# EAGLE design ESP8266Controller (EAGLE 7.6.0)
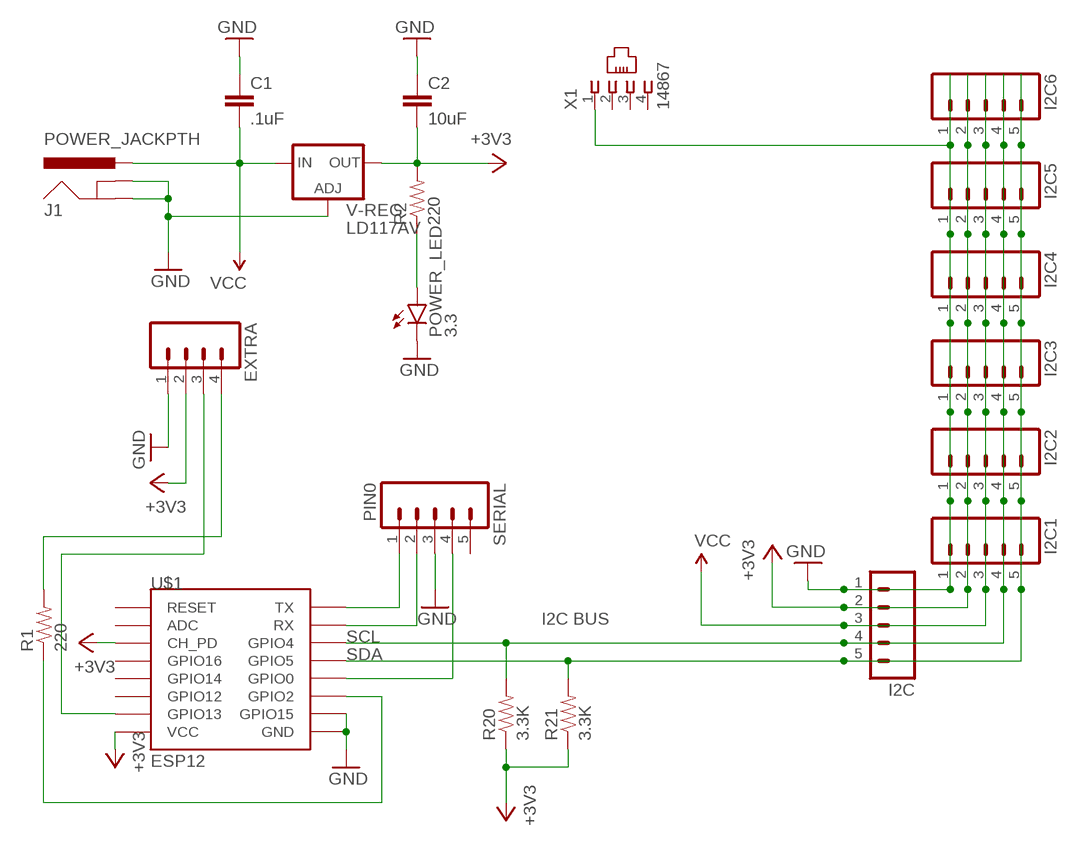
[diagram p0: schematic, sheet 1]

## Parts
C1  .1uF  CAPPTH  [CAP-PTH-SMALL]
C2  10uF  CAPPTH  [CAP-PTH-SMALL]
EXTRA  M04  [04P]
I2C  M05  [05P]
I2C1  M05  [05P]
I2C2  M05  [05P]
I2C3  M05  [05P]
I2C4  M05  [05P]
I2C5  M05  [05P]
I2C6  M05  [05P]
J1  POWER_JACKPTH  [POWER_JACK_PTH]
POWER_LED  3.3  LED5MM  [LED5MM]
R1  220  RESISTORPTH-1/4W  [AXIAL-0.4]
R2  220  RESISTORPTH-1/4W  [AXIAL-0.4]
R20  3.3K  RESISTORPTH-1/4W  [AXIAL-0.4]
R21  3.3K  RESISTORPTH-1/4W  [AXIAL-0.4]
SERIAL  PIN0  M05  [05P]
U$1  ESP12  [ESP12]
V-REG  LD117AV  [TO220L1]
X1  14867  [14867]

## Nets
+3V3: C2.2 EXTRA.2 I2C1.2 I2C2.2 I2C3.2 I2C4.2 I2C5.2 I2C6.2 I2C.2 R2.P$2 R20.P$1 R21.P$1 U$1.CH_PD U$1.VCC V-REG.2(OUT)
GND: C1.1 C2.1 EXTRA.1 I2C1.1 I2C2.1 I2C3.1 I2C4.1 I2C5.1 I2C6.1 I2C.1 J1.GND J1.GNDBREAK POWER_LED.K(C) SERIAL.3 U$1.GND U$1.GPIO15 V-REG.1(ADJ) X1.1
N$1: EXTRA.4 R1.P$2
N$2: R1.P$1 U$1.GPIO2
N$3: EXTRA.3 U$1.GPIO13
N$4: SERIAL.1 U$1.TX
N$7: POWER_LED.A R2.P$1
N$11: SERIAL.2 U$1.RX
N$19: SERIAL.4 U$1.GPIO0
SCL: I2C1.4 I2C2.4 I2C3.4 I2C4.4 I2C5.4 I2C6.4 I2C.4 R20.P$2 U$1.GPIO4
SDA: I2C1.5 I2C2.5 I2C3.5 I2C4.5 I2C5.5 I2C6.5 I2C.5 R21.P$2 U$1.GPIO5
VCC: C1.2 I2C1.3 I2C2.3 I2C3.3 I2C4.3 I2C5.3 I2C6.3 I2C.3 J1.PWR V-REG.3(IN)
Unconnected: SERIAL.5 U$1.ADC U$1.GPIO12 U$1.GPIO14 U$1.GPIO16 U$1.RESET X1.2 X1.3 X1.4

## Notes on the sheet
- I2C BUS

## Library data of the parts
C1 C2 = SparkFun-Capacitors:CAP: Capacitor Standard 0603 ceramic capacitor, and 0.1" leaded capacitor.
EXTRA = con-amp-quick:M04: AMP QUICK CONNECTOR; OC_FARNELL: unknown; OC_NEWARK: unknown
I2C I2C1-I2C6 SERIAL = con-amp-quick:M05: AMP QUICK CONNECTOR; OC_FARNELL: unknown; OC_NEWARK: unknown
J1 = SparkFun-Connectors:POWER_JACK: Power Jack This is the standard 5.5mm barrel jack for power. The PTH is the most common, proven, reliable, footprint. The Slot footprint only works if the mill layer is transmitted to the PCB fab house so be warned. Mating wall wart : TOL-00298 (and others); PROD_ID: CONN-08197
POWER_LED = SparkFun-LED:LED: LEDs Standard schematic elements and footprints for 5mm, 3mm, 1206, and 0603 sized LEDs. 5mm - Spark Fun Electronics SKU : COM-00529 (and others)
R1 R2 R20 R21 = SparkFun-Resistors:RESISTOR: Resistor Basic schematic elements and footprints for 0603, 1206, and PTH resistors.
U$1 = esp8266modules:ESP12: ESP8266 Wifi module 12
V-REG = v-reg:LD117A?*: Low drop fixed and adjustable positive voltage regulators 1 A Source: http://www.st.com/stonline/products/literature/ds/7194/ld1117axx.pdf
X1 = con-4ucon:14867: RJ11 Connector Source: 4UCON TECHNOLOGY INC. 14867.pdf; OC_FARNELL: unknown; OC_NEWARK: unknown

## Board
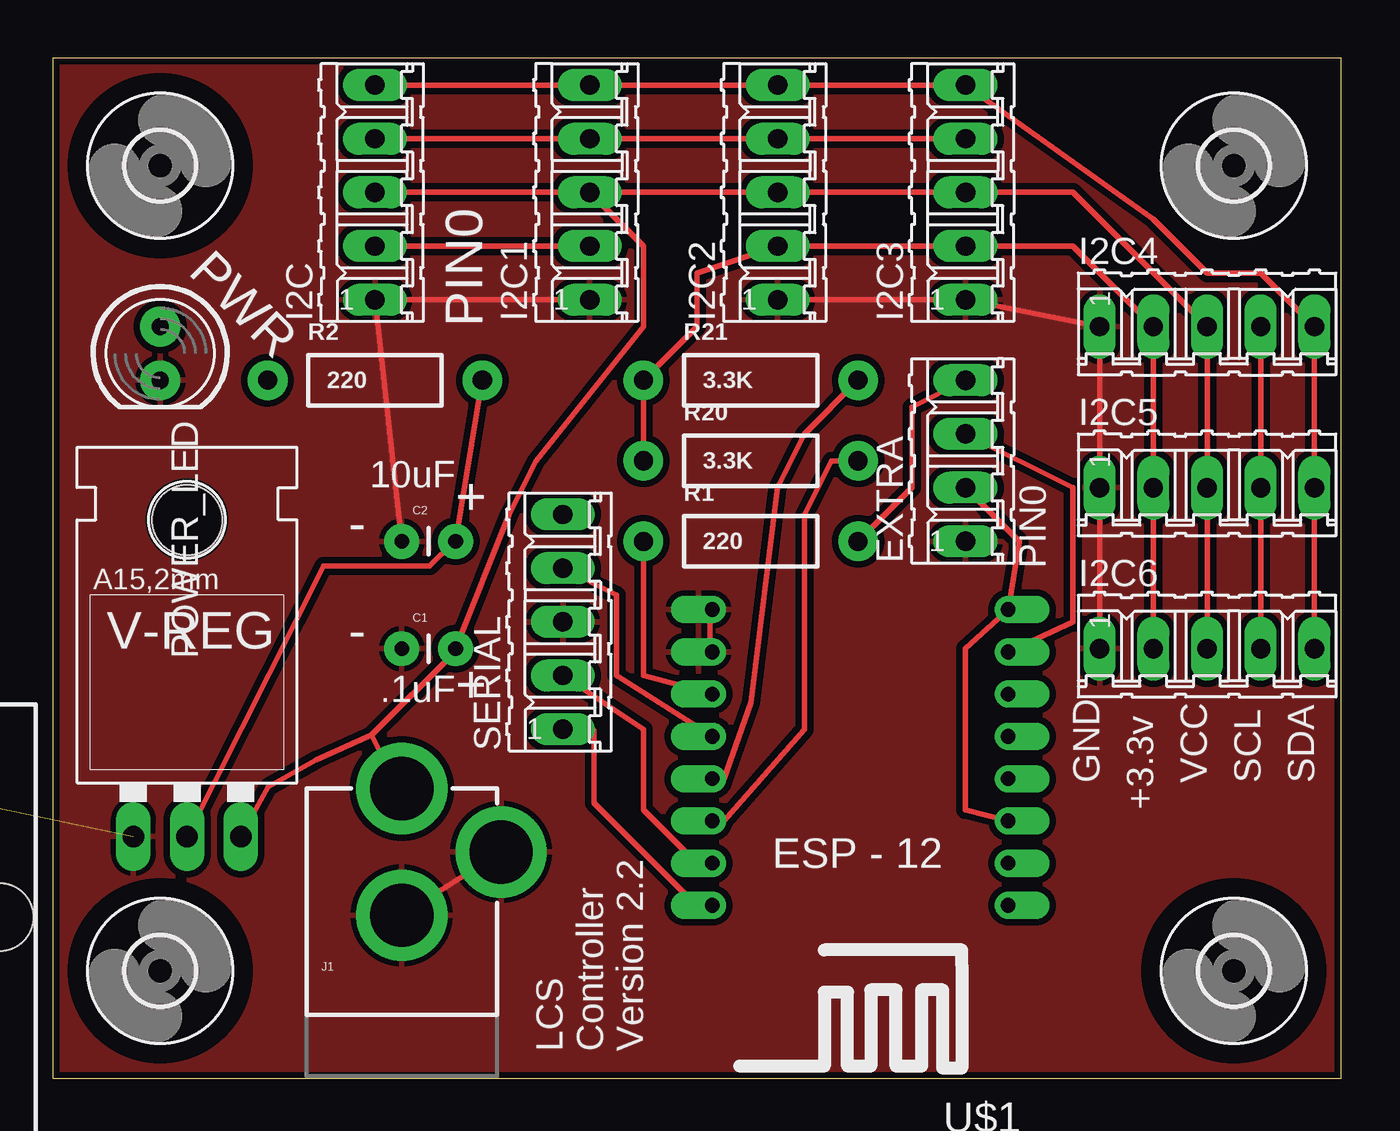
[diagram p1: board, top side]
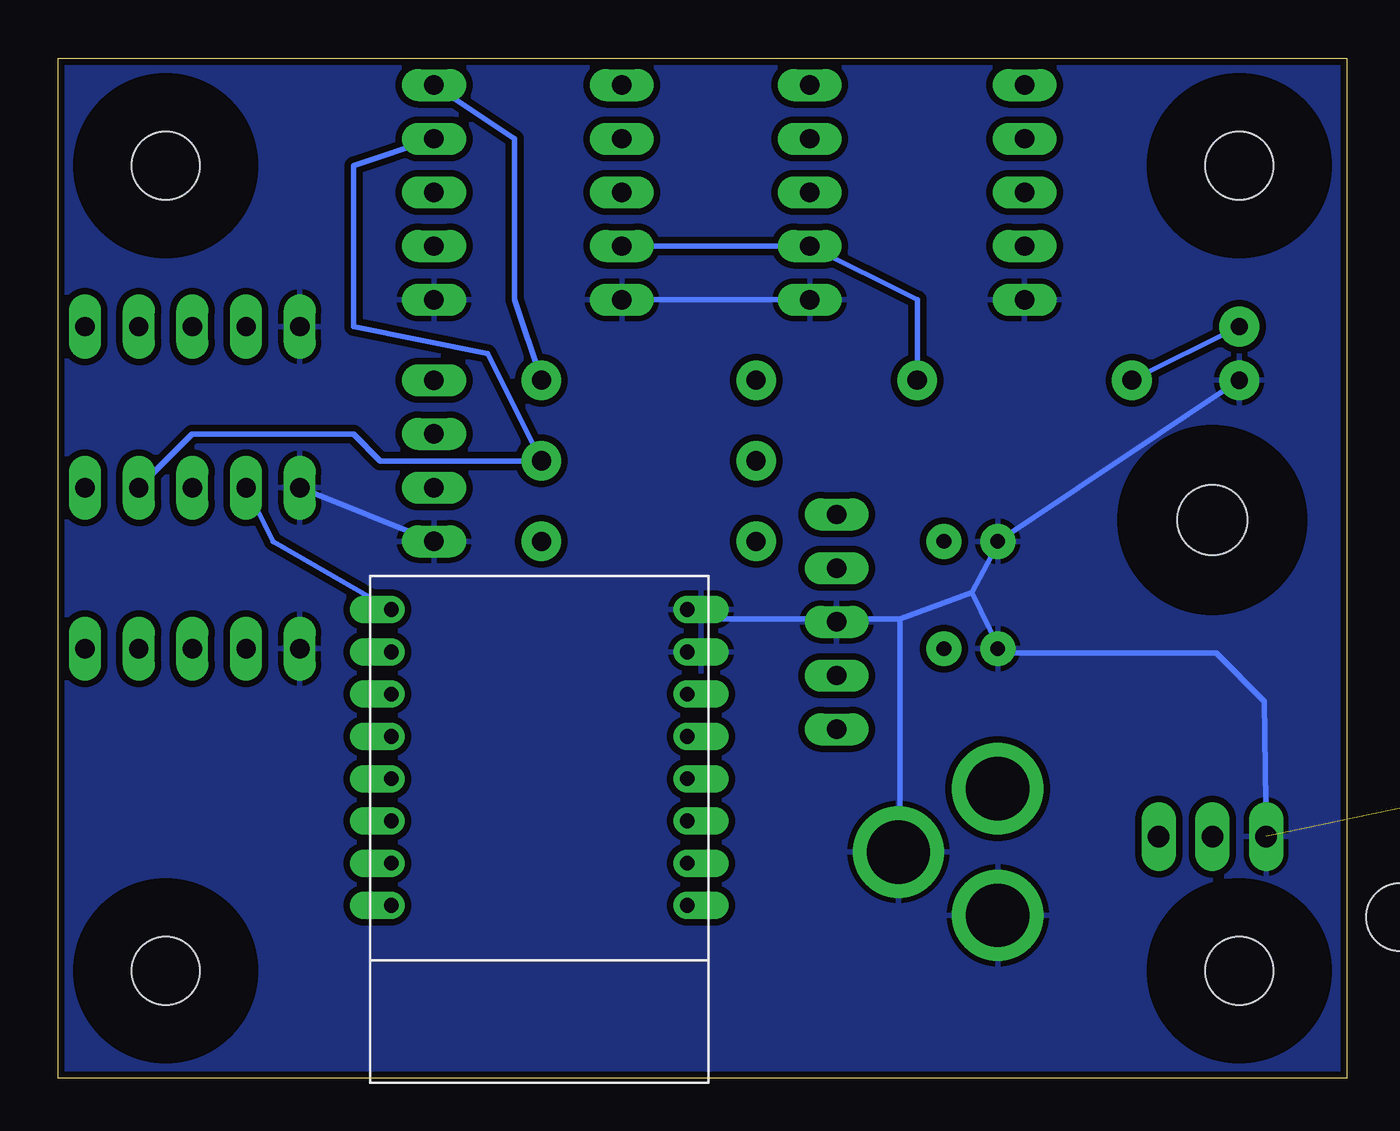
[diagram p2: board, bottom side, seen from below]

Size 60.96 x 48.26 mm. Coordinates in mm from the lower left corner, seen from the top.
Outline: 0,0 60.96,0 60.96,48.26 0,48.26 0,0
Copper layers (1*16): Top 0.035mm / dielectric 1.5mm / Bottom 0.035mm
Design rules "SparkFun": minimum track width 8mil, minimum drill 20mil, track to track 8mil, track to pad 8mil, pad to pad 8mil, via to via 8mil, smd to smd 8mil, copper to edge 8mil, drill to drill 8mil, minimum pad ring 12mil, minimum via ring 10mil, stop-mask expansion 4mil, vias tented up to drill 20mil, thermal gap 10mil

### Footprints (pad centres in the part's own frame; a part is rotated, then mirrored left to right if it is on the bottom)
CAP-PTH-SMALL = drill 0.7 pad 1.651: 1 0,0; 2 2.54,0
04P = drill 0.914 long: 1 -3.81,0; 2 -1.27,0; 3 1.27,0; 4 3.81,0
05P = drill 0.914 long: 1 -5.08,0; 2 -2.54,0; 3 0,0; 4 2.54,0; 5 5.08,0
POWER_JACK_PTH = drill 2.997 pad 4.318: GND 0,7.7; GNDBREAK 4.7,10.7; PWR 0,13.7
LED5MM = drill 0.813 pad 1.88: A -1.27,0; K 1.27,0
AXIAL-0.4 = drill 0.9 pad 1.88: P$1 -5.08,0; P$2 5.08,0
ESP12 = drill 0.7 offset: ADC -7.1,3.8; CH_PD -7.1,1.8; GND 6.9,-8.2; GPIO0 6.9,-2.2; GPIO2 6.9,-4.2; GPIO4 6.9,1.8; GPIO5 6.9,-0.2; GPIO12 -7.1,-4.2; GPIO13 -7.1,-6.2; GPIO14 -7.1,-2.2; GPIO15 6.9,-6.2; GPIO16 -7.1,-0.2; RESET -7.1,5.8; RX 6.9,3.8; TX 6.9,5.8; VCC -7.1,-8.2
3,2 = hole 3.2: 0,0
TO220L1 = drill 1.016 long: 1 -2.54,-3.81; 2 0,-3.81; 3 2.54,-3.81 | hole 3.302: 0,11.176
14867 = drill 0.9 pad 1.422: 1 -1.905,6.35; 2 -0.635,8.89; 3 0.635,6.35; 4 1.905,8.89 | hole 3.2: -3.81,0; 3.81,0

### Placement (x,y rotation side)
C1  16.51,20.32 0 top
C2  16.51,25.4 0 top
EXTRA  43.18,29.21 90 top
I2C  15.24,41.91 90 top
I2C1  25.4,41.91 90 top
I2C2  34.29,41.91 90 top
I2C3  43.18,41.91 90 top
I2C4  54.61,35.56 0 top
I2C5  54.61,27.94 0 top
I2C6  54.61,20.32 0 top
J1  16.51,0 0 top
POWER_LED  5.08,34.29 270 top
R1  33.02,25.4 0 top
R2  15.24,33.02 0 top
R20  33.02,29.21 0 top
R21  33.02,33.02 0 top
SERIAL  24.13,21.59 90 top
U$1  38.1,13.97 180 top
U$2  [3,2]  5.08,43.18 0 top
U$3  [3,2]  5.08,5.08 0 top
U$4  [3,2]  55.88,5.08 0 top
U$5  [3,2]  55.88,43.18 0 top
V-REG  6.35,15.24 0 top
X1  -6.35,7.62 0 top

### Tracks (layer width: path | path; a pad name or v marks a point on that pad's centre or on a via)
+3V3
  Top 0.254: V-REG.2 12.8,24.23 17.83,24.23 18.97,25.38 C2.2 R2.P$2 | I2C1.2 I2C.2 | I2C6.2 I2C5.2 I2C4.2 48.26,39.37 I2C3.2 I2C2.2 30.48,38.1 30.48,35.56 R21.P$1 R20.P$1 | EXTRA.2 45.72,25.4 U$1.VCC 43.18,20.32 43.18,12.7 U$1.CH_PD
  Bottom 0.254: I2C2.2 I2C1.2 20.32,36.83 R2.P$2 | I2C5.2 50.8,25.4 U$1.VCC
GND  (1 unrouted)
  Top 0.254: U$1.GPIO15 31.09,20.34 31.09,21.95 U$1.GND | I2C1.1 I2C.1 C2.1 | I2C2.1 I2C3.1 I2C4.1 I2C5.1 I2C6.1 | J1.GND J1.GNDBREAK
  Bottom 0.254: U$1.GND 31.09,21.95 30.86,21.72 25.6,21.72 SERIAL.3 22.84,21.72 21.13,21.72 | 17.73,22.99 16.46,20.34 C1.1 16.46,20.12 6.17,20.12 3.89,17.83 V-REG.1 | 17.73,22.99 16.46,25.38 C2.1 POWER_LED.K | 17.73,22.99 21.13,21.72 | 21.13,21.72 21.13,10.74 J1.GNDBREAK | I2C1.1 I2C2.1 | EXTRA.1 I2C5.1
  pour Top (isolate 0.305): 0,0 0,48.26 60.96,48.26 60.96,0
  pour Bottom (isolate 0.305): 0,0 0,48.26 60.96,48.26 60.96,0
N$1
  Top 0.254: R1.P$2 40.64,27.94 40.64,31.75 EXTRA.4
N$2
  Top 0.254: R1.P$1 27.94,19.05 U$1.GPIO2
N$3
  Top 0.254: EXTRA.3 48.26,27.94 48.26,21.59 U$1.GPIO13
N$4
  Top 0.254: U$1.TX 31.09,8.23 30.4,8.23 25.6,13.03 25.6,16.46 SERIAL.1
N$5
  pour Bottom (isolate 0.305): 0,0 0,48.26 60.96,48.26 60.96,0
N$7
  Bottom 0.254: POWER_LED.A R2.P$1
N$11
  Top 0.254: U$1.RX 30.47,10.17 27.94,12.7 27.94,16.51 SERIAL.2
N$19
  Top 0.254: SERIAL.4 26.67,22.86 26.67,19.05 U$1.GPIO0
SCL
  Top 0.254: I2C.4 I2C1.4 I2C2.4 I2C3.4 | U$1.GPIO4 31.75,12.17 35.56,16.51 35.56,26.67 36.83,29.21 R20.P$2 | I2C4.4 I2C5.4 I2C6.4
  Bottom 0.254: I2C5.4 54.61,30.48 46.99,30.48 45.72,29.21 R20.P$2 40.64,34.29 46.99,35.56 46.99,43.18 I2C3.4
SDA
  Top 0.254: I2C.5 I2C1.5 I2C2.5 I2C3.5 52.07,40.64 54.61,38.1 57.15,38.1 I2C4.5 I2C5.5 I2C6.5 | U$1.GPIO5 31.75,14.17 33.02,17.78 34.29,27.94 35.56,30.48 R21.P$2
  Bottom 0.254: R21.P$2 39.37,36.83 39.37,44.45 I2C3.5
VCC
  Top 0.254: 15.09,16.23 16.33,13.72 J1.PWR | 15.09,16.23 12.45,15.06 10.19,13.79 V-REG.3 | 15.09,16.23 18.97,20.12 C1.2 21.59,26.67 22.86,29.21 27.94,35.56 27.94,39.37 I2C1.3 | I2C1.3 I2C2.3 I2C3.3 48.26,41.91 I2C4.3 I2C5.3 I2C6.3 | I2C1.3 I2C.3

### Text on the board
tPlace: PWR | PIN0 | 10uF | + | - | PIN0 | - | .1uF | + | GND | VCC | SCL | SDA | +3.3v | LCS / Controller / Version 2.2